# Altium project 123.PrjPcb
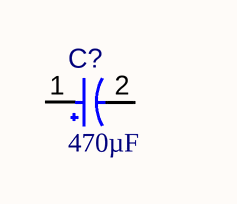
[diagram p0: Sheet1.SchDoc]
1 sheet, 1 parts. Net scope: global (net labels, ports and power ports of the same name join across sheets).
Board file: PCB1.PcbDoc

## Sheet Sheet1.SchDoc
size A; SheetNumber: 1; SheetTotal: 1

### Parts
C?  value 470µF  [CAPPR65-500-2000X1000X2200]  (hidden comment: ECA-1HM471)

### Nets

Not connected (* = marked no-connect by the designer): C? 1 2

### Library data of the parts
C? = CMP-001-00032-8: Aluminum Electrolytic Capacitor, 470 uF, +/- 20%, 50 V, -40 to 85 degC, 2-Pin THD, RoHS, Bulk; Manufacturer: Panasonic; Ripple Current: 650mA; Voltage Rating: 50V; Ripple Current (AC): 650mA; Packaging: Bulk; Capacitor Type: Electrolytic; Diameter: 10mm; Datasheet URL: http://industrial.panasonic.com/cdbs/www-data/pdf/RDF0000/ABA0000C1047.pdf; Case/Package: Radial; Tolerance: 20%; Max Operating Temperature: 85°C; Pins: 2; Min Operating Temperature: -40°C; RoHS Compliant: True; Mounting Technology: TH; Package Quantity: 200; Lead Pitch: 5mm; Manufacturer URL: http://www.panasonic.com/; Package Description: 2-Pin Radial Lead, Dia 10 mm, Height 22 mm; Datasheet Version: Mar-16; Package Reference: CAPPR65-500-2000X1000X2200